# Altium schematic sheet 01_COVER PAGE.SchDoc
size 420 x 297 mm; SheetNumber: 1; SheetTotal: 7
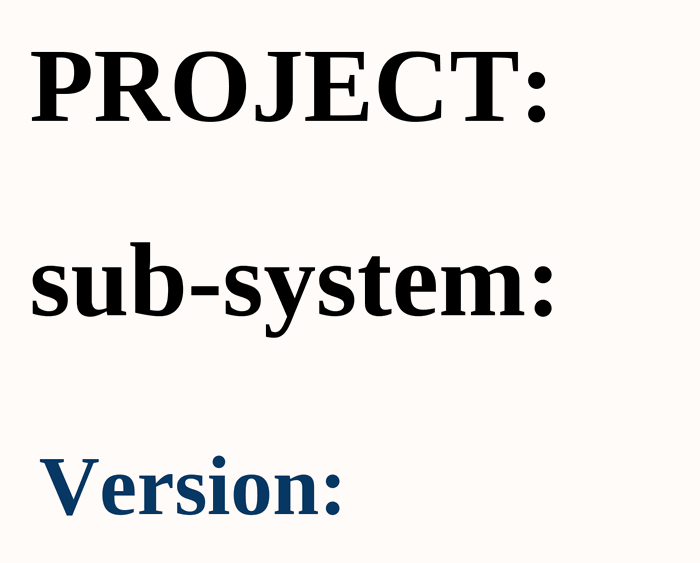
[diagram p0: 01_COVER PAGE.SchDoc]

## Notes on the sheet
- PROJECT:
- sub-system:
- Version:
- Sub-system:
- Project:
- Design by:
- Sheet title:
- Sheet
- of
- Checked by:
- Approved by:
- Doc No:
- Revision:
- Size:
- Date:
- A3